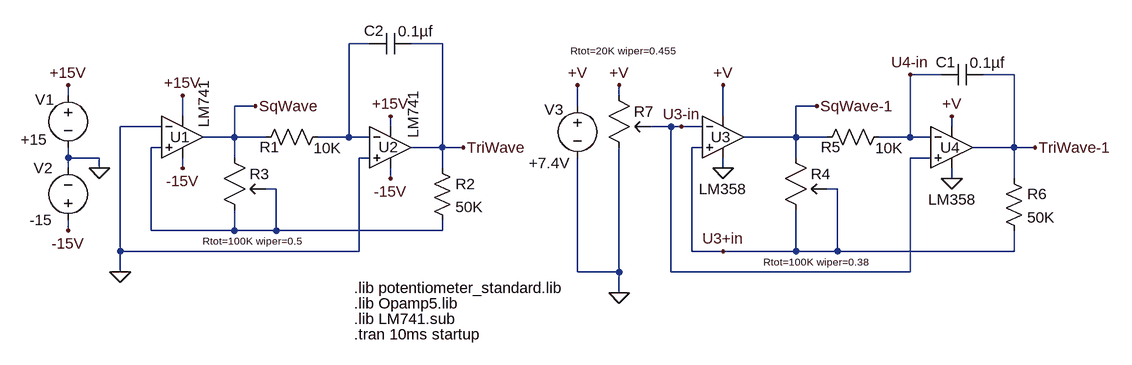
[diagram p0: schematic PWMMotorController-OpAmp.asc]
PWMMotorController-OpAmp.asc, the LTspice schematic file:
Version 4
SHEET 1 1620 680
WIRE -240 -128 -272 -128
WIRE -128 -128 -176 -128
WIRE 640 -80 592 -80
WIRE 752 -80 704 -80
WIRE -704 -48 -704 -64
WIRE 144 -48 144 -64
WIRE -416 -32 -448 -32
WIRE 80 -32 80 -64
WIRE 448 -32 416 -32
WIRE -528 -16 -528 -48
WIRE 304 -16 304 -64
WIRE -560 0 -624 0
WIRE -208 0 -208 -16
WIRE 224 0 192 0
WIRE 240 0 224 0
WIRE 272 0 240 0
WIRE 656 0 656 -16
WIRE -448 16 -448 -32
WIRE -448 16 -496 16
WIRE -400 16 -448 16
WIRE -272 16 -272 -128
WIRE -272 16 -320 16
WIRE -240 16 -272 16
WIRE 416 16 416 -32
WIRE 416 16 336 16
WIRE 464 16 416 16
WIRE 592 16 592 -80
WIRE 592 16 544 16
WIRE 624 16 592 16
WIRE -560 32 -576 32
WIRE -128 32 -128 -128
WIRE -128 32 -176 32
WIRE -96 32 -128 32
WIRE 272 32 256 32
WIRE 752 32 752 -80
WIRE 752 32 688 32
WIRE 784 32 752 32
WIRE -704 48 -704 32
WIRE -656 48 -704 48
WIRE -448 48 -448 16
WIRE -240 48 -256 48
WIRE 416 48 416 16
WIRE 624 48 592 48
WIRE -704 64 -704 48
WIRE -656 64 -656 48
WIRE -528 64 -528 48
WIRE -128 64 -128 32
WIRE 304 64 304 48
WIRE -208 80 -208 64
WIRE 656 80 656 64
WIRE 752 80 752 32
WIRE -384 96 -400 96
WIRE 480 96 464 96
WIRE -704 160 -704 144
WIRE -576 160 -576 32
WIRE -448 160 -448 128
WIRE -448 160 -576 160
WIRE -384 160 -384 96
WIRE -384 160 -448 160
WIRE -128 160 -128 144
WIRE -128 160 -384 160
WIRE -624 192 -624 0
WIRE -256 192 -256 48
WIRE -256 192 -624 192
WIRE 256 192 256 32
WIRE 304 192 256 192
WIRE 416 192 416 128
WIRE 416 192 304 192
WIRE 480 192 480 96
WIRE 480 192 416 192
WIRE 752 192 752 160
WIRE 752 192 480 192
WIRE -624 224 -624 192
WIRE 80 224 80 48
WIRE 144 224 144 32
WIRE 144 224 80 224
WIRE 224 224 224 0
WIRE 592 224 592 48
WIRE 592 224 224 224
WIRE 144 256 144 224
FLAG -624 224 0
FLAG -416 -32 SqWave
FLAG -96 32 TriWave
FLAG -656 64 0
FLAG -704 -64 +15V
FLAG -704 160 -15V
FLAG -528 -48 +15V
FLAG -208 -16 +15V
FLAG -528 64 -15V
FLAG -208 80 -15V
FLAG 144 256 0
FLAG 448 -32 SqWave-1
FLAG 784 32 TriWave-1
FLAG 80 -64 +V
FLAG 304 -64 +V
FLAG 656 -16 +V
FLAG 304 64 0
FLAG 656 80 0
FLAG 144 -64 +V
FLAG 240 0 U3-in
FLAG 304 192 U3+in
FLAG 592 -80 U4-in
SYMBOL potentiometer -464 32 R0
WINDOW 0 39 41 Left 2
WINDOW 3 -33 144 Left 1
SYMATTR InstName R3
SYMATTR Value Rtot=100K wiper=0.5
SYMBOL res -304 0 R90
WINDOW 0 47 90 VBottom 2
WINDOW 3 33 22 VLeft 2
SYMATTR InstName R1
SYMATTR Value 10K
SYMBOL cap -176 -144 R90
WINDOW 0 12 57 VBottom 2
WINDOW 3 -3 20 VLeft 2
SYMATTR InstName C2
SYMATTR Value 0.1µf
SYMBOL OpAmps\\opamp2 -528 -48 R0
WINDOW 3 33 50 VLeft 2
WINDOW 0 -19 64 Left 2
SYMATTR Value LM741
SYMATTR InstName U1
SYMBOL OpAmps\\opamp2 -208 -32 R0
WINDOW 3 35 50 VLeft 2
WINDOW 0 -18 63 Left 2
SYMATTR Value LM741
SYMATTR InstName U2
SYMBOL res -144 48 R0
SYMATTR InstName R2
SYMATTR Value 50K
SYMBOL voltage -704 -64 R0
WINDOW 0 -51 22 Left 2
WINDOW 3 -73 84 Left 2
SYMATTR InstName V1
SYMATTR Value +15
SYMBOL voltage -704 160 R180
WINDOW 0 24 96 Left 2
WINDOW 3 24 16 Left 2
SYMATTR InstName V2
SYMATTR Value -15
SYMBOL potentiometer 400 32 R0
WINDOW 0 39 41 Left 2
WINDOW 3 -34 176 Left 1
SYMATTR InstName R4
SYMATTR Value Rtot=100K wiper=0.38
SYMBOL res 560 0 R90
WINDOW 0 47 90 VBottom 2
WINDOW 3 33 22 VLeft 2
SYMATTR InstName R5
SYMATTR Value 10K
SYMBOL cap 704 -96 R90
WINDOW 0 12 57 VBottom 2
WINDOW 3 -3 20 VLeft 2
SYMATTR InstName C1
SYMATTR Value 0.1µf
SYMBOL OpAmps\\opamp2 304 -48 R0
WINDOW 3 0 144 Center 2
WINDOW 0 -19 64 Left 2
SYMATTR Value LM358
SYMATTR InstName U3
SYMBOL OpAmps\\opamp2 656 -32 R0
WINDOW 3 1 144 Center 2
WINDOW 0 -18 64 Left 2
SYMATTR Value LM358
SYMATTR InstName U4
SYMBOL res 736 64 R0
SYMATTR InstName R6
SYMATTR Value 50K
SYMBOL voltage 80 -48 R0
WINDOW 0 -51 22 Left 2
WINDOW 3 -75 104 Left 2
SYMATTR InstName V3
SYMATTR Value +7.4V
SYMBOL potentiometer 128 -64 R0
WINDOW 0 39 41 Left 2
WINDOW 3 -59 -53 Left 1
SYMATTR InstName R7
SYMATTR Value Rtot=20K wiper=0.455
TEXT -264 248 Left 2 !.lib potentiometer_standard.lib
TEXT -264 320 Left 2 !.tran 10ms startup
TEXT -264 296 Left 2 !.lib LM741.sub
TEXT -264 272 Left 2 !.lib Opamp5.lib

The netlist it stands for:
* PWMMotorController-OpAmp.asc
XR3 SqWave N002 N002 potentiometer Rtot=100K wiper=0.5  ; pins A B C
R1 N001 SqWave 10K
C2 TriWave N001 0.1µf
XU1 N002 0 +15V -15V SqWave LM741  ; pins In+ In- V+ V- OUT
XU2 0 N001 +15V -15V TriWave LM741  ; pins In+ In- V+ V- OUT
R2 TriWave N002 50K
V1 +15V 0 +15
V2 -15V 0 -15
XR4 SqWave-1 U3+in U3+in potentiometer Rtot=100K wiper=0.38  ; pins A B C
R5 U4-in SqWave-1 10K
C1 TriWave-1 U4-in 0.1µf
XU3 U3+in U3-in +V 0 SqWave-1 LM358  ; pins In+ In- V+ V- OUT
XU4 U3-in U4-in +V 0 TriWave-1 LM358  ; pins In+ In- V+ V- OUT
R6 TriWave-1 U3+in 50K
V3 +V 0 +7.4V
XR7 +V 0 U3-in potentiometer Rtot=20K wiper=0.455  ; pins A B C
.lib potentiometer_standard.lib
.tran 10ms startup
.lib LM741.sub
.lib Opamp5.lib
.backanno
.end